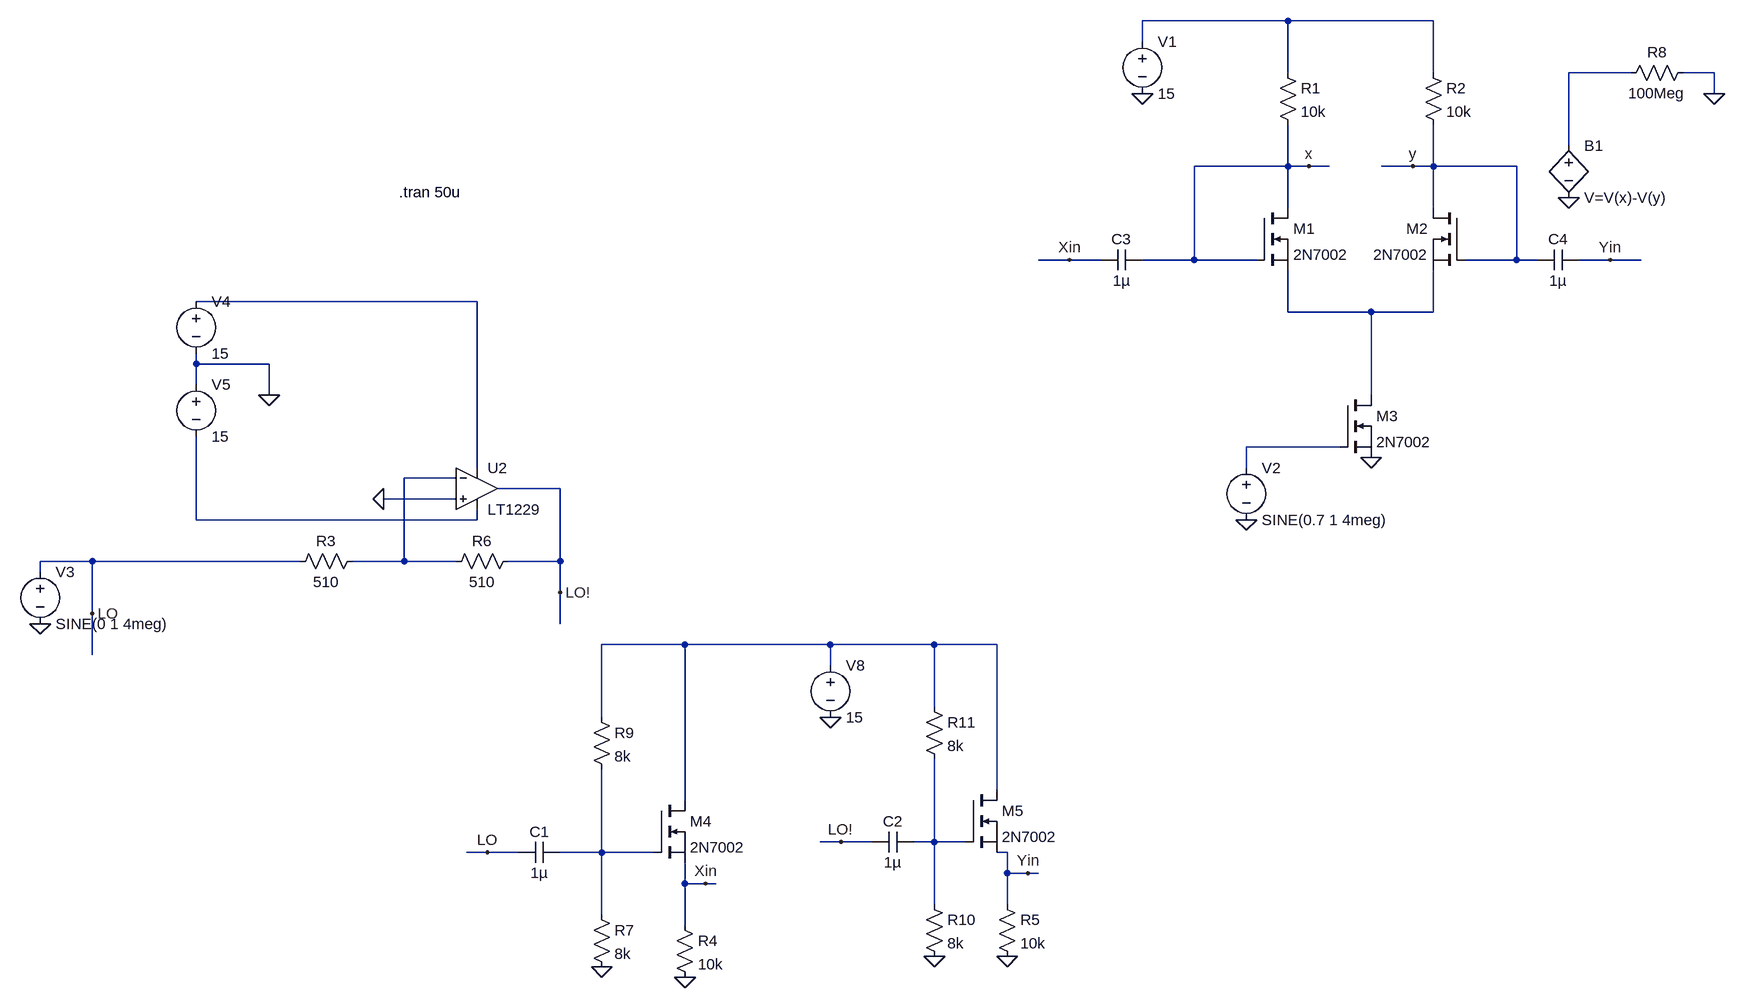
[diagram p0: schematic Project3.asc]
Project3.asc, the LTspice schematic file:
Version 4
SHEET 1 1364 964
WIRE 688 -528 464 -528
WIRE 912 -528 688 -528
WIRE 464 -496 464 -528
WIRE 688 -448 688 -528
WIRE 912 -448 912 -528
WIRE 1216 -448 1120 -448
WIRE 1344 -448 1296 -448
WIRE 1344 -416 1344 -448
WIRE 1120 -336 1120 -448
WIRE 688 -304 688 -368
WIRE 688 -304 544 -304
WIRE 720 -304 688 -304
WIRE 752 -304 720 -304
WIRE 880 -304 832 -304
WIRE 912 -304 912 -368
WIRE 912 -304 880 -304
WIRE 1040 -304 912 -304
WIRE 688 -240 688 -304
WIRE 912 -240 912 -304
WIRE 352 -160 304 -160
WIRE 400 -160 352 -160
WIRE 544 -160 544 -304
WIRE 544 -160 464 -160
WIRE 640 -160 544 -160
WIRE 1040 -160 1040 -304
WIRE 1040 -160 960 -160
WIRE 1072 -160 1040 -160
WIRE 1184 -160 1136 -160
WIRE 1232 -160 1184 -160
WIRE -560 -96 -992 -96
WIRE 688 -80 688 -144
WIRE 816 -80 688 -80
WIRE 912 -80 912 -144
WIRE 912 -80 816 -80
WIRE -992 0 -992 -16
WIRE -880 0 -992 0
WIRE -992 32 -992 0
WIRE -880 48 -880 0
WIRE 816 48 816 -80
WIRE 768 128 624 128
WIRE -560 160 -560 -96
WIRE 624 160 624 128
WIRE -592 176 -672 176
WIRE -432 192 -528 192
WIRE -592 208 -704 208
WIRE -992 240 -992 112
WIRE -560 240 -560 224
WIRE -560 240 -992 240
WIRE -1152 304 -1232 304
WIRE -832 304 -1152 304
WIRE -672 304 -672 176
WIRE -672 304 -752 304
WIRE -592 304 -672 304
WIRE -432 304 -432 192
WIRE -432 304 -512 304
WIRE -1232 320 -1232 304
WIRE -432 352 -432 304
WIRE -1152 384 -1152 304
WIRE -432 400 -432 352
WIRE -240 432 -368 432
WIRE -16 432 -240 432
WIRE 144 432 -16 432
WIRE 240 432 144 432
WIRE -1152 448 -1152 384
WIRE -16 464 -16 432
WIRE 144 528 144 432
WIRE -368 544 -368 432
WIRE 240 656 240 432
WIRE -240 672 -240 432
WIRE 0 736 -32 736
WIRE 48 736 0 736
WIRE 144 736 144 608
WIRE 144 736 112 736
WIRE 192 736 144 736
WIRE -544 752 -576 752
WIRE -496 752 -544 752
WIRE -368 752 -368 624
WIRE -368 752 -432 752
WIRE -288 752 -368 752
WIRE 256 752 240 752
WIRE 256 784 256 752
WIRE 288 784 256 784
WIRE 304 784 288 784
WIRE -240 800 -240 768
WIRE -208 800 -240 800
WIRE -192 800 -208 800
WIRE 144 832 144 736
WIRE 256 832 256 784
WIRE -368 848 -368 752
WIRE -240 864 -240 800
FLAG 464 -416 0
FLAG 816 144 0
FLAG 624 240 0
FLAG -1232 400 0
FLAG -880 48 0
FLAG 1120 -256 0
FLAG 1344 -416 0
FLAG 720 -304 x
FLAG 880 -304 y
FLAG -704 208 0
FLAG -1152 384 LO
FLAG -432 352 LO!
FLAG -16 544 0
FLAG -240 944 0
FLAG -368 928 0
FLAG 144 912 0
FLAG -544 752 LO
FLAG 0 736 LO!
FLAG 256 912 0
FLAG -208 800 Xin
FLAG 288 784 Yin
FLAG 352 -160 Xin
FLAG 1184 -160 Yin
DATAFLAG 912 -272 ""
DATAFLAG 912 -112 ""
DATAFLAG 736 -80 ""
DATAFLAG 688 -256 ""
DATAFLAG -240 800 ""
DATAFLAG -336 752 ""
DATAFLAG -240 560 ""
DATAFLAG 240 592 ""
DATAFLAG 256 800 ""
DATAFLAG 144 704 ""
DATAFLAG 592 -160 ""
DATAFLAG 1056 -160 ""
SYMBOL res 672 -464 R0
SYMATTR InstName R1
SYMATTR Value 10k
SYMBOL res 896 -464 R0
SYMATTR InstName R2
SYMATTR Value 10k
SYMBOL voltage 464 -512 R0
WINDOW 123 0 0 Left 0
WINDOW 39 0 0 Left 0
SYMATTR InstName V1
SYMATTR Value 15
SYMBOL voltage 624 144 R0
WINDOW 123 0 0 Left 0
WINDOW 39 0 0 Left 0
SYMATTR InstName V2
SYMATTR Value SINE(0.7 1 4meg)
SYMBOL nmos 640 -240 R0
SYMATTR InstName M1
SYMATTR Value 2N7002
SYMBOL nmos 960 -240 M0
SYMATTR InstName M2
SYMATTR Value 2N7002
SYMBOL nmos 768 48 R0
SYMATTR InstName M3
SYMATTR Value 2N7002
SYMBOL OpAmps\\LT1229 -560 128 R0
SYMATTR InstName U2
SYMBOL res -496 288 R90
WINDOW 0 0 56 VBottom 2
WINDOW 3 32 56 VTop 2
SYMATTR InstName R6
SYMATTR Value 510
SYMBOL voltage -1232 304 R0
WINDOW 123 0 0 Left 0
WINDOW 39 0 0 Left 0
SYMATTR InstName V3
SYMATTR Value SINE(0 1 4meg)
SYMBOL res -736 288 R90
WINDOW 0 0 56 VBottom 2
WINDOW 3 32 56 VTop 2
SYMATTR InstName R3
SYMATTR Value 510
SYMBOL voltage -992 -112 R0
WINDOW 123 0 0 Left 0
WINDOW 39 0 0 Left 0
SYMATTR InstName V4
SYMATTR Value 15
SYMBOL voltage -992 16 R0
WINDOW 123 0 0 Left 0
WINDOW 39 0 0 Left 0
SYMATTR InstName V5
SYMATTR Value 15
SYMBOL res 1312 -464 R90
WINDOW 0 0 56 VBottom 2
WINDOW 3 32 56 VTop 2
SYMATTR InstName R8
SYMATTR Value 100Meg
SYMBOL bv 1120 -352 R0
SYMATTR InstName B1
SYMATTR Value V=V(x)-V(y)
SYMBOL nmos -288 672 R0
SYMATTR InstName M4
SYMATTR Value 2N7002
SYMBOL nmos 192 656 R0
SYMATTR InstName M5
SYMATTR Value 2N7002
SYMBOL res -256 848 R0
SYMATTR InstName R4
SYMATTR Value 10k
SYMBOL voltage -16 448 R0
WINDOW 123 0 0 Left 0
WINDOW 39 0 0 Left 0
SYMATTR InstName V8
SYMATTR Value 15
SYMBOL cap -432 736 R90
WINDOW 0 0 32 VBottom 2
WINDOW 3 32 32 VTop 2
SYMATTR InstName C1
SYMATTR Value 1µ
SYMBOL cap 112 720 R90
WINDOW 0 0 32 VBottom 2
WINDOW 3 32 32 VTop 2
SYMATTR InstName C2
SYMATTR Value 1µ
SYMBOL res -384 832 R0
SYMATTR InstName R7
SYMATTR Value 8k
SYMBOL res -384 528 R0
SYMATTR InstName R9
SYMATTR Value 8k
SYMBOL res 128 816 R0
SYMATTR InstName R10
SYMATTR Value 8k
SYMBOL res 128 512 R0
SYMATTR InstName R11
SYMATTR Value 8k
SYMBOL res 240 816 R0
SYMATTR InstName R5
SYMATTR Value 10k
SYMBOL cap 464 -176 R90
WINDOW 0 0 32 VBottom 2
WINDOW 3 32 32 VTop 2
SYMATTR InstName C3
SYMATTR Value 1µ
SYMBOL cap 1136 -176 R90
WINDOW 0 0 32 VBottom 2
WINDOW 3 32 32 VTop 2
SYMATTR InstName C4
SYMATTR Value 1µ
TEXT -680 -264 Left 2 !.tran 50u

The netlist it stands for:
* Project3.asc
R1 N001 x 10k
R2 N001 y 10k
V1 N001 0 15
V2 N005 0 SINE(0.7 1 4meg)
M1 x x N004 N004 2N7002
M2 y y N004 N004 2N7002
M3 N004 N005 0 0 2N7002
XU2 0 N006 N003 N007 LO! LT1229  ; pins In+ In- V+ V- OUT
R6 LO! N006 510
V3 LO 0 SINE(0 1 4meg)
R3 N006 LO 510
V4 N003 0 15
V5 0 N007 15
R8 0 N002 100Meg
B1 N002 0 V=V(x)-V(y)
M4 N008 N010 Xin Xin 2N7002
M5 N008 N009 Yin Yin 2N7002
R4 Xin 0 10k
V8 N008 0 15
C1 N010 LO 1µ
C2 N009 LO! 1µ
R7 N010 0 8k
R9 N008 N010 8k
R10 N009 0 8k
R11 N008 N009 8k
R5 Yin 0 10k
C3 x Xin 1µ
C4 Yin y 1µ
.model NMOS NMOS
.model PMOS PMOS
.lib standard.mos
.tran 50u
.backanno
.end